# Altium schematic sheet Lab5_TB_Sheet1.SchDoc
size A; SheetNumber: 1; SheetTotal: 1; SPICEModelCacheMKTVASGV: <root> / <DocumentId>MKTVASGV</DocumentId> / <CacheFrame Number="0"> / <Model Name="notsimulated" Kind="CKT"> / <Text>.SUBCKT NOTSIMULATED 1 / .ENDS NOTSIMULATED</Text> / </Model> / <Model Name="idealopamp_5nodes" Kind="CKT"> / <Text>*------------------------ / .SUBCKT IdealOpamp_5nodes  In+ In- VCC VEE Out PARAMS: GAIN=1Meg / RVCC VCC 0 1 / RVEE VEE 0 1 / E1 Out 0 In+ In- {Gain} / R1 In+ In- 1e12 / .ENDS</Text> / </Model> / </CacheFrame> / </root>
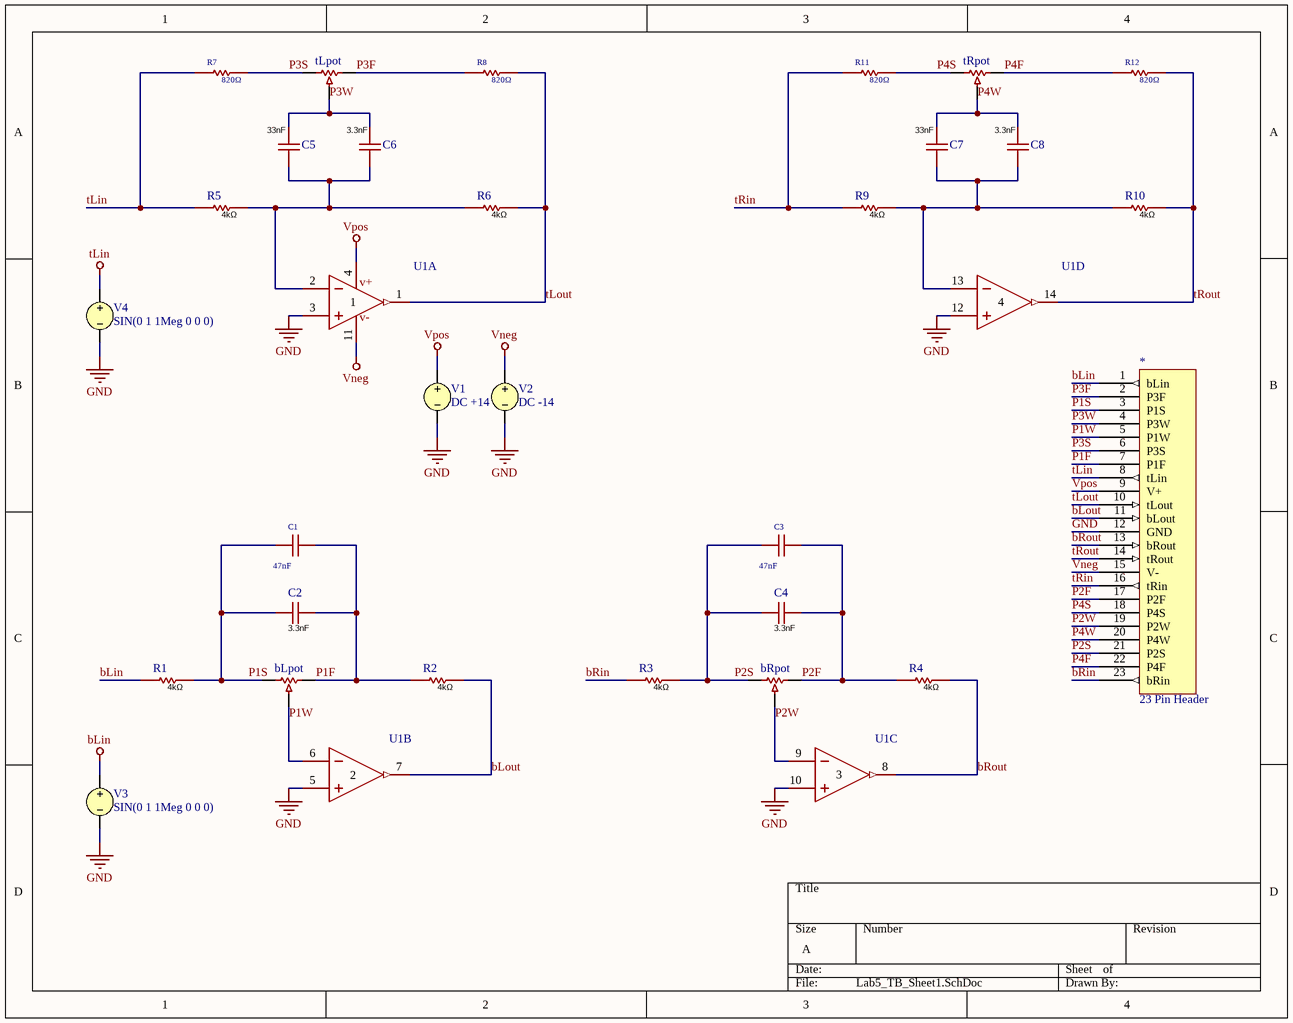
[diagram p0: Lab5_TB_Sheet1.SchDoc]

## Parts
*  23 Pin Header  [KBS_23pin_Header_TB_EQ]
bLpot  kbs_pot  (value not drawn)
bRpot  kbs_pot  (value not drawn)
C1  value 47nF  [C1206]  (hidden comment: GRM31M5C1H473JA01L)
C2  value 3.3nF  [C0805]  (hidden comment: 0805B332K500NT)
C3  value 47nF  [C1206]  (hidden comment: GRM31M5C1H473JA01L)
C4  value 3.3nF  [C0805]  (hidden comment: 0805B332K500NT)
C5  value 33nF  [C0805]  (hidden comment: 0805B333K500NT)
C6  value 3.3nF  [C0805]  (hidden comment: 0805B332K500NT)
C7  value 33nF  [C0805]  (hidden comment: 0805B333K500NT)
C8  value 3.3nF  [C0805]  (hidden comment: 0805B332K500NT)
R1  value 4kΩ  [R0805]  (hidden comment: ARG05FTC4001N)
R2  value 4kΩ  [R0805]  (hidden comment: ARG05FTC4001N)
R3  value 4kΩ  [R0805]  (hidden comment: ARG05FTC4001N)
R4  value 4kΩ  [R0805]  (hidden comment: ARG05FTC4001N)
R5  value 4kΩ  [R0805]  (hidden comment: ARG05FTC4001N)
R6  value 4kΩ  [R0805]  (hidden comment: ARG05FTC4001N)
R7  value 820Ω  [R0603]  (hidden comment: 0603WAF8200T5E)
R8  value 820Ω  [R0603]  (hidden comment: 0603WAF8200T5E)
R9  value 4kΩ  [R0805]  (hidden comment: ARG05FTC4001N)
R10  value 4kΩ  [R0805]  (hidden comment: ARG05FTC4001N)
R11  value 820Ω  [R0603]  (hidden comment: 0603WAF8200T5E)
R12  value 820Ω  [R0603]  (hidden comment: 0603WAF8200T5E)
tLpot  kbs_pot  (value not drawn)
tRpot  kbs_pot  (value not drawn)
U1  LM324DT  [KBS_SO14_w_Guide_Pin_Holes]  (value not drawn)  (parts A,B,C,D of 4)
V1  DC +14
V2  DC -14
V3  SIN(0 1 1Meg 0 0 0)
V4  SIN(0 1 1Meg 0 0 0)

## Nets
bLin: *.1(bLin) R1.1 V3.1
GND: *.12(GND) U1.3(IN1+) U1.5(IN2+) U1.10(IN3+) U1.12(IN4+) V1.2 V2.2 V3.2 V4.2
tLin: *.8(tLin) R5.1 R7.1 V4.1
Vneg: *.15(V-) U1.11(VCC-) V2.1
Vpos: *.9(V+) U1.4(VCC+) V1.1
bLout: *.11(bLout) R2.2 U1.7(OUT2)
bRin: *.23(bRin) R3.1
bRout: *.13(bRout) R4.2 U1.8(OUT3)
P1F: *.7(P1F) bLpot.1(End2) C1.2 C2.1 R2.1
P1S: *.3(P1S) bLpot.0(End1) C1.1 C2.2 R1.2
P1W: *.5(P1W) bLpot.2(Wiper) U1.6(IN2-)
P2F: *.17(P2F) bRpot.1(End2) C3.2 C4.1 R4.1
P2S: *.21(P2S) bRpot.0(End1) C3.1 C4.2 R3.2
P2W: *.19(P2W) bRpot.2(Wiper) U1.9(IN3-)
P3F: *.2(P3F) R8.1 tLpot.1(End2)
P3S: *.6(P3S) R7.2 tLpot.0(End1)
P3W: *.4(P3W) C5.2 C6.2 tLpot.2(Wiper)
P4F: *.22(P4F) R12.1 tRpot.1(End2)
P4S: *.18(P4S) R11.2 tRpot.0(End1)
P4W: *.20(P4W) C7.2 C8.2 tRpot.2(Wiper)
tLout: *.10(tLout) R6.2 R8.2 U1.1(OUT1)
tRin: *.16(tRin) R9.1 R11.1
tRout: *.14(tRout) R10.2 R12.2 U1.14(OUT4)
NetC5_1: C5.1 C6.1 R5.2 R6.1 U1.2(IN1-)
NetC7_1: C7.1 C8.1 R9.2 R10.1 U1.13(IN4-)

## Notes on the sheet
- (in symbol LM324DT, part A) v+; v-

## Library data of the parts
bLpot bRpot tLpot tRpot = kbs_pot: value: 10k; position: 0.5
C1 C3 = GRM31M5C1H473JA01L: Capacitance: Tolerance:±5% Tolerance:±5% Voltage Rated: Temperature Coefficient:; Manufacturer: muRata(村田); Add into BOM: yes; Tolerance: ±5%; Symbol: GRM31M5C1H473JA01L; Device: GRM31M5C1H473JA01L; JLCPCB Part Class: Extended Part; Supplier: LCSC; Manufacturer Part: GRM31M5C1H473JA01L; Supplier Part: C21812; LCSC Part Name: 47nF ±5% 50V; Supplier Footprint: 1206; Datasheet: https://atta.szlcsc.com/upload/public/pdf/source/20180228/C21812_15198055830211377594.pdf; Convert to PCB: yes
C2 C4 C6 C8 = 0805B332K500NT: Capacitance:3.3nF Tolerance:±10% Tolerance:±10% Voltage Rated: Temperature Coefficient:; Manufacturer: FH(风华); Add into BOM: yes; Tolerance: ±10%; Symbol: 0805B332K500NT; Device: 0805B332K500NT; LCSC Part Name: 3.3nF ±10% 50V; Supplier Part: C1738; Manufacturer Part: 0805B332K500NT; Supplier Footprint: 0805; JLCPCB Part Class: Extended Part; Datasheet: https://atta.szlcsc.com/upload/public/pdf/source/20200305/C486355_26A10D38EF8C2A5C37091D0039909270.pdf; Supplier: LCSC; Convert to PCB: yes
C5 C7 = 0805B333K500NT: Capacitance:33nF Tolerance:±10% Tolerance:±10% Voltage Rated: Temperature Coefficient:; Manufacturer: FH(风华); Add into BOM: yes; Tolerance: ±10%; Symbol: 0805B333K500NT; Device: 0805B333K500NT; LCSC Part Name: 33nF ±10% 50V; Supplier Part: C1739; Manufacturer Part: 0805B333K500NT; Supplier Footprint: 0805; JLCPCB Part Class: Basic Part; Datasheet: https://atta.szlcsc.com/upload/public/pdf/source/20200305/C486355_26A10D38EF8C2A5C37091D0039909270.pdf; Supplier: LCSC; Convert to PCB: yes
R1-R6 R9 R10 = ARG05FTC4001N: Type:Thin Film Resistor Resistance: Tolerance:±1% Tolerance:±1% Power(Watts): Overload Voltage (Max): Temperature Coefficient:±25ppm/℃ Temperature Coefficient:±25ppm/℃ Operating Temperature Range:-55℃~+155℃ Operating Temperature Range:-55℃~+155℃; Manufacturer: Viking(光颉); Add into BOM: yes; Tolerance: ±1%; Symbol: ARG05FTC4001N; Device: ARG05FTC4001N; LCSC Part Name: 薄膜电阻 4kΩ ±1% 125mW; Supplier Part: C2828855; Manufacturer Part: ARG05FTC4001N; Supplier Footprint: 0805; Datasheet: https://atta.szlcsc.com/upload/public/pdf/source/20211009/C2828883_CAE7D170B8B230FC4A048BDC7B3A81FC.pdf; Supplier: LCSC; Convert to PCB: yes; Type: Thin Film Resistor; Temperature Coefficient: ±25ppm/℃; Operating Temperature Range: -55℃~+155℃
R7 R8 R11 R12 = 0603WAF8200T5E: Type:Thick Film Resistors Resistance: Tolerance:±1% Tolerance:±1% Power(Watts): Overload Voltage (Max): Temperature Coefficient:±100ppm/℃ Temperature Coefficient:±100ppm/℃ Operating Temperature Range:-55℃~+155℃ Operating Temperature Range:-55℃~+155℃; Manufacturer: UNI-ROYAL(厚声); Add into BOM: yes; Tolerance: ±1%; Symbol: 0603WAF8200T5E; Device: 0603WAF8200T5E; Supplier: LCSC; Manufacturer Part: 0603WAF8200T5E; Supplier Part: C23253; LCSC Part Name: 820Ω ±1% 100mW 厚膜电阻; Supplier Footprint: 0603; Datasheet: https://atta.szlcsc.com/upload/public/pdf/source/20200306/C422600_1E6D84923E4A46A82E41ADD87F860B5C.pdf; Convert to PCB: yes; Type: Thick Film Resistors; Temperature Coefficient: ±100ppm/℃; Operating Temperature Range: -55℃~+155℃
U1 = LM324DT: Number of Circuits:Quad Gain Bandwidth Product(GBP):1.3MHz Current - Input Bias(Ib):20nA Slew Rate(SR):0.4V/us Output Current:40mA -3db Bandwidth:- Supply Current:1.5mA Operating Temperature:0℃~+70℃ Operating Temperature:0℃~+70℃; Manufacturer: ST(意法半导体); Add into BOM: yes; Number of Circuits: Quad; Gain Bandwidth Product(GBP): 1.3MHz; Current - Input Bias(Ib): 20nA; Output Current: 40mA; Supply Current: 1.5mA; Relevance: []; Symbol: LM324DT; Device: LM324DT; LCSC Part Name: LM324DT; Supplier Part: C71035; Manufacturer Part: LM324DT; Supplier Footprint: SOIC-14; JLCPCB Part Class: Basic Part; Datasheet: https://atta.szlcsc.com/upload/public/pdf/source/20160408/1460100649718.pdf; Supplier: LCSC; Convert to PCB: yes; Slew Rate(SR): 0.4V/us; -3db Bandwidth: -; Operating Temperature: 0℃~+70℃
V1 V2 = VSRC: Voltage Source; Note: PCB Footprint - Not required; AC Magnitude: 1; AC Phase: 0; Published: 8-Jun-2000; LatestRevisionDate: 17-Jul-2002; LatestRevisionNote: Re-released for DXP Platform.; PackageReference: Not Applicable; Publisher: Altium Limited
  V1: Value: +14
  V2: Value: -14
V3 V4 = VSRC: Voltage Source; Note: PCB Footprint - Not required; AC Magnitude: 1; AC Phase: 0; DC Magnitude: 5; Published: 8-Jun-2000; LatestRevisionDate: 17-Jul-2002; LatestRevisionNote: Re-released for DXP Platform.; PackageReference: Not Applicable; Publisher: Altium Limited; Offset: 0; Amplitude: 1; Frequency: 1Meg; Delay: 0; Damping Factor: 0; Phase: 0